# EAGLE schematic E-piano (EAGLE 9.4.0)
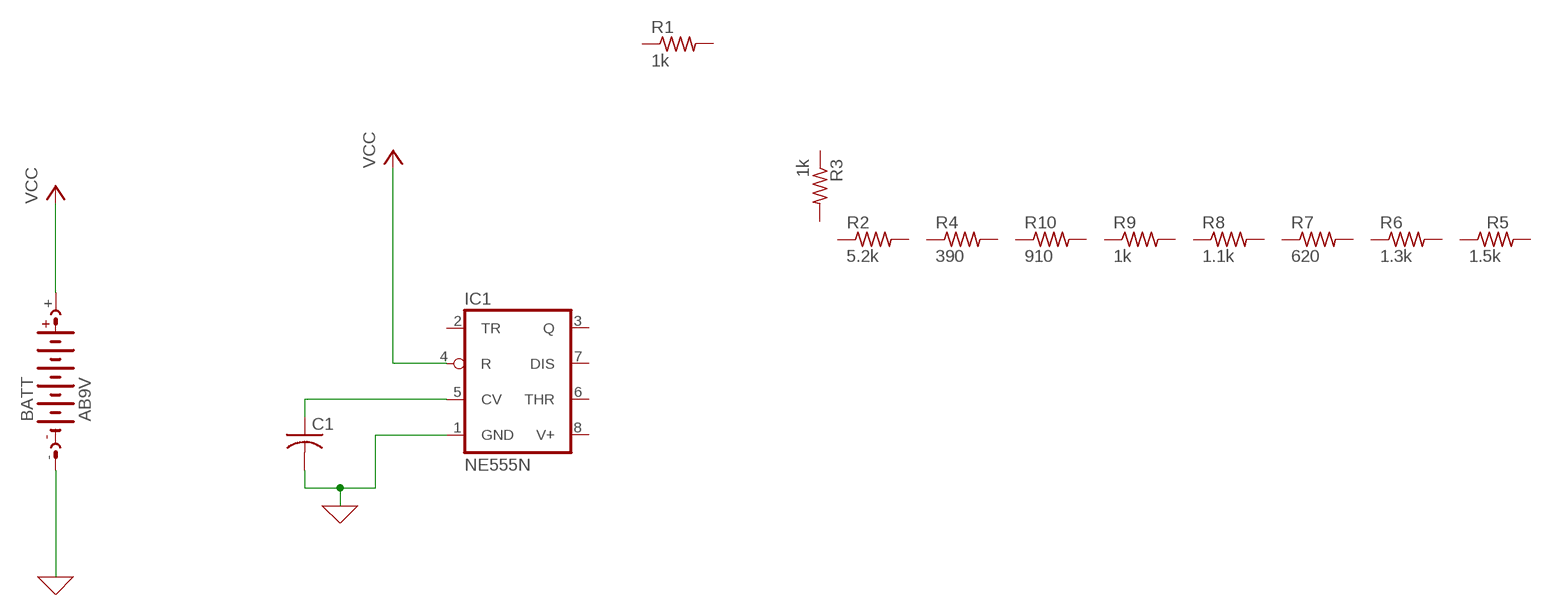
[diagram p0: schematic, sheet 1]

## Parts
BATT  AB9V  [AB9V]
C1  C-US025-025X050  [C025-025X050]
IC1  NE555N  [DIL08]
R1  1k  R-US_0207/10  [0207/10]
R2  5.2k  R-US_0207/10  [0207/10]
R3  1k  R-US_0207/10  [0207/10]
R4  390  R-US_0207/10  [0207/10]
R5  1.5k  R-US_0207/10  [0207/10]
R6  1.3k  R-US_0207/10  [0207/10]
R7  620  R-US_0207/10  [0207/10]
R8  1.1k  R-US_0207/10  [0207/10]
R9  1k  R-US_0207/10  [0207/10]
R10  910  R-US_0207/10  [0207/10]

## Nets
0: BATT.- C1.2 IC1.1(GND) ; supply symbol labelled GND
N$2: C1.1 IC1.5(CV)
VCC: BATT.+ IC1.4(R)
Unconnected: IC1.2(TR) IC1.3(Q) IC1.6(THR) IC1.7(DIS) R1.1 R1.2 R2.1 R2.2 R3.1 R3.2 R4.1 R4.2 R5.1 R5.2 R6.1 R6.2 R7.1 R7.2 R8.1 R8.2 R9.1 R9.2 R10.1 R10.2

## Power pins joined to a net without a drawn wire
V+: IC1.8(V+)

## Library data of the parts
BATT = battery:AB9V: 9-V BATTERY CLIP
C1 = rcl:C-US: CAPACITOR, American symbol; SPICEPREFIX: C
IC1 = linear:*555: TIMER
R1-R10 = rcl:R-US_: RESISTOR, American symbol; SPICEPREFIX: R